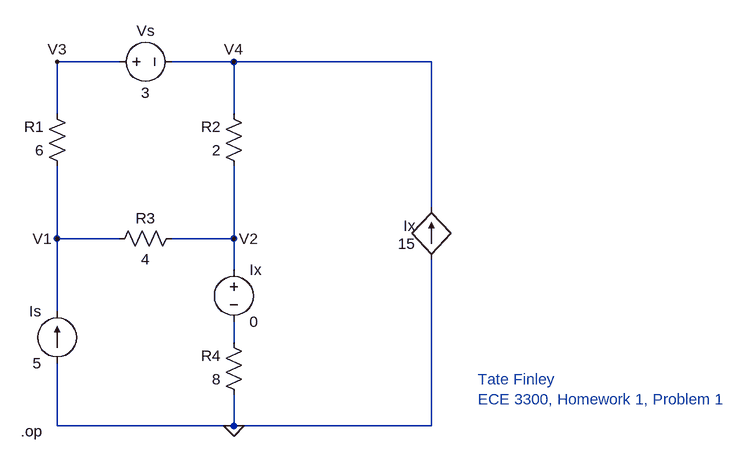
[diagram p0: schematic ECE3300_Fall2023_HW1_Problem1.asc]
ECE3300_Fall2023_HW1_Problem1.asc, the LTspice schematic file:
Version 4
SHEET 1 1124 680
WIRE 96 -48 0 -48
WIRE 272 -48 176 -48
WIRE 576 -48 272 -48
WIRE 0 32 0 -48
WIRE 272 32 272 -48
WIRE 576 176 576 -48
WIRE 0 224 0 112
WIRE 96 224 0 224
WIRE 272 224 272 112
WIRE 272 224 176 224
WIRE 272 272 272 224
WIRE 0 336 0 224
WIRE 272 384 272 352
WIRE 0 512 0 416
WIRE 272 512 272 464
WIRE 272 512 0 512
WIRE 576 512 576 256
WIRE 576 512 272 512
FLAG 0 -48 V3
FLAG 272 -48 V4
FLAG 272 224 V2
FLAG 0 224 V1
FLAG 272 512 0
SYMBOL voltage 80 -48 R270
WINDOW 0 32 56 VTop 2
WINDOW 3 -32 56 VBottom 2
WINDOW 123 0 0 Left 0
WINDOW 39 0 0 Left 0
SYMATTR InstName Vs
SYMATTR Value 3
SYMBOL res 16 128 R180
WINDOW 0 36 76 Left 2
WINDOW 3 36 40 Left 2
SYMATTR InstName R1
SYMATTR Value 6
SYMBOL res 288 128 R180
WINDOW 0 36 76 Left 2
WINDOW 3 36 40 Left 2
SYMATTR InstName R2
SYMATTR Value 2
SYMBOL res 80 240 R270
WINDOW 0 32 56 VTop 2
WINDOW 3 0 56 VBottom 2
SYMATTR InstName R3
SYMATTR Value 4
SYMBOL res 288 480 R180
WINDOW 0 36 76 Left 2
WINDOW 3 36 40 Left 2
SYMATTR InstName R4
SYMATTR Value 8
SYMBOL current 0 416 R180
WINDOW 0 24 80 Left 2
WINDOW 3 24 0 Left 2
WINDOW 123 0 0 Left 0
WINDOW 39 0 0 Left 0
SYMATTR InstName Is
SYMATTR Value 5
SYMBOL f 576 256 R180
WINDOW 0 24 80 Invisible 2
WINDOW 3 24 52 Left 2
WINDOW 123 24 24 Left 2
SYMATTR InstName F1
SYMATTR Value Ix
SYMATTR Value2 15
SYMBOL voltage 272 256 R0
WINDOW 123 0 0 Left 0
WINDOW 39 0 0 Left 0
SYMATTR InstName Ix
SYMATTR Value 0
TEXT -56 520 Left 2 !.op
TEXT 648 440 Left 2 ;Tate Finley\nECE 3300, Homework 1, Problem 1

The netlist it stands for:
* ECE3300_Fall2023_HW1_Problem1.asc
Vs V3 V4 3
R1 V1 V3 6
R2 V2 V4 2
R3 V1 V2 4
R4 0 N001 8
Is 0 V1 5
F1 0 V4 Ix 15
V§Ix V2 N001 0
.op
* Tate Finley
* ECE 3300, Homework 1, Problem 1
.backanno
.end